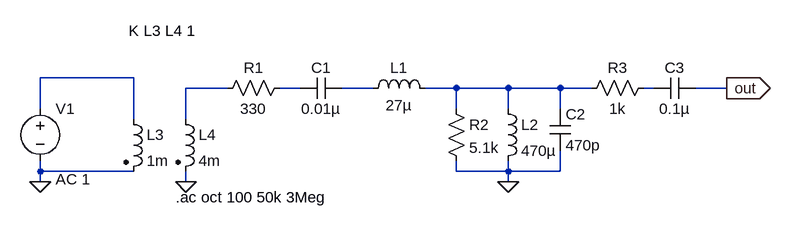
[diagram p0: schematic ISL_rx.asc]
ISL_rx.asc, the LTspice schematic file:
Version 4
SHEET 1 880 680
WIRE -128 112 -272 112
WIRE 16 128 -48 128
WIRE 128 128 96 128
WIRE 240 128 192 128
WIRE 368 128 320 128
WIRE 448 128 368 128
WIRE 528 128 448 128
WIRE 576 128 528 128
WIRE 672 128 656 128
WIRE 784 128 736 128
WIRE -272 160 -272 112
WIRE 368 160 368 128
WIRE 448 160 448 128
WIRE 528 160 528 128
WIRE -128 176 -128 112
WIRE -48 176 -48 128
WIRE -272 256 -272 240
WIRE -128 256 -272 256
WIRE 368 256 368 240
WIRE 448 256 448 240
WIRE 448 256 368 256
WIRE 528 256 528 224
WIRE 528 256 448 256
WIRE -272 272 -272 256
WIRE -48 272 -48 256
WIRE 448 272 448 256
FLAG 448 272 0
FLAG -272 272 0
FLAG 784 128 out
IOPIN 784 128 Out
FLAG -48 272 0
SYMBOL res 112 112 R90
WINDOW 0 0 56 VBottom 2
WINDOW 3 32 56 VTop 2
SYMATTR InstName R1
SYMATTR Value 330
SYMBOL cap 192 112 R90
WINDOW 0 0 32 VBottom 2
WINDOW 3 32 32 VTop 2
SYMATTR InstName C1
SYMATTR Value 0.01µ
SYMBOL ind 224 144 R270
WINDOW 0 32 56 VTop 2
WINDOW 3 5 56 VBottom 2
SYMATTR InstName L1
SYMATTR Value 27µ
SYMBOL res 352 144 R0
SYMATTR InstName R2
SYMATTR Value 5.1k
SYMBOL ind 432 144 R0
SYMATTR InstName L2
SYMATTR Value 470µ
SYMBOL cap 512 160 R0
SYMATTR InstName C2
SYMATTR Value 470p
SYMBOL voltage -272 144 R0
WINDOW 3 24 152 Left 2
WINDOW 123 24 124 Left 2
WINDOW 39 0 0 Left 2
SYMATTR Value ""
SYMATTR Value2 AC 1
SYMATTR InstName V1
SYMBOL cap 736 112 R90
WINDOW 0 0 32 VBottom 2
WINDOW 3 32 32 VTop 2
SYMATTR InstName C3
SYMATTR Value 0.1µ
SYMBOL res 672 112 R90
WINDOW 0 0 56 VBottom 2
WINDOW 3 32 56 VTop 2
SYMATTR InstName R3
SYMATTR Value 1k
SYMBOL ind2 -144 160 R0
SYMATTR InstName L3
SYMATTR Value 1m
SYMBOL ind2 -64 160 R0
SYMATTR InstName L4
SYMATTR Value 4m
TEXT -64 296 Left 2 !.ac oct 100 50k 3Meg
TEXT -136 40 Left 2 !K L3 L4 1

The netlist it stands for:
* ISL_rx.asc
R1 N003 N002 330
C1 N004 N003 0.01µ
L1 N004 N005 27µ
R2 N005 0 5.1k
L2 N005 0 470µ
C2 N005 0 470p
V1 N001 0 AC 1
C3 out N006 0.1µ
R3 N006 N005 1k
L3 N001 0 1m
L4 N002 0 4m
.ac oct 100 50k 3Meg
K L3 L4 1
.backanno
.end